# Altium project COBAND.PrjPcb
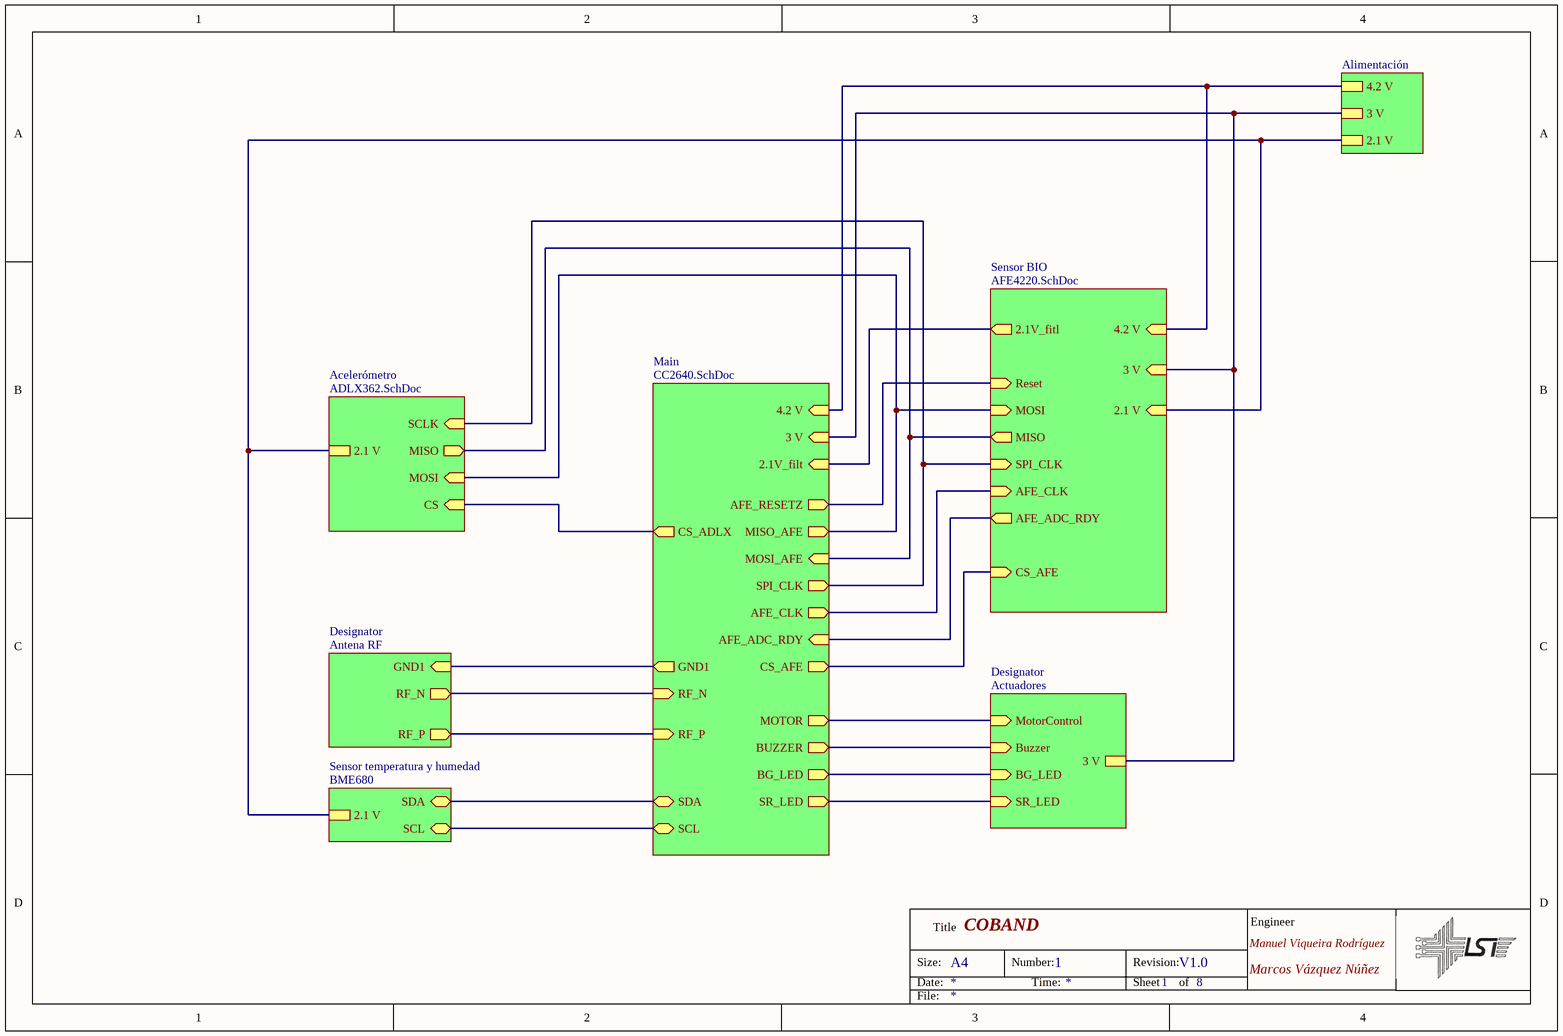
[diagram p0: main.SchDoc]
8 sheets, 70 parts. Net scope: hierarchical (ports join the sheet entries above them; power ports are global).
Board file: testDEOP.PcbDoc
Sheets:
  main.SchDoc
    Main = CC2640.SchDoc
    Designator = Antena RF.SchDoc
     = Alimentación.SchDoc
    Designator = Actuadores.SchDoc
    Acelerómetro = ADLX362.SchDoc
    Sensor temperatura y humedad = BME680.SchDoc
    Sensor BIO = AFE4220.SchDoc

## Sheet main.SchDoc: COBAND
size A4; ENG_APP_DATE: --/--/--; DSN_APP_DATE: --/--/--; CHK_APP_DATE: --/--/--; CompanyName: MUISE; Engineer: Manuel Viqueira Rodríguez; Organization: ETSI Telecomunicaciones; Address1: Av. Complutense, 30; Address2: , 28040 Madrid; Address3: Madrid; Address4: España; DocumentNumber: 1; Revision: V1.0; SheetNumber: 1; SheetTotal: 8; Engineer2: Marcos Vázquez Núñez

### Sub-sheets
Acelerómetro = ADLX362.SchDoc: MISO (out), MOSI (in), SCLK (in), CS (in), 2.1 V
Designator = Antena RF: RF_N (out), RF_P (out), GND1 (in)
Designator = Actuadores: MotorControl (in), Buzzer (in), BG_LED (in), SR_LED (in), 3 V
Main = CC2640.SchDoc: MOSI_AFE (in), AFE_RESETZ (out), MISO_AFE (out), SPI_CLK (out), AFE_ADC_RDY (in), BG_LED (out), SR_LED (out), MOTOR (out), BUZZER (out), CS_ADLX (out), RF_N (in), RF_P (in), SDA (bidir), SCL (bidir), AFE_CLK (out), CS_AFE (out), 2.1V_filt (in), 3 V (in), 4.2 V (in), GND1 (out)
Sensor BIO = AFE4220.SchDoc: Reset (in), SPI_CLK (in), MOSI (in), CS_AFE (in), AFE_CLK (in), MISO (out), AFE_ADC_RDY (out), 4.2 V (in), 3 V (in), 2.1 V (in), 2.1V_fitl (out)
Sensor temperatura y humedad = BME680: SDA (bidir), SCL (bidir), 2.1 V
? = Alimentación: 4.2 V, 3 V, 2.1 V

### Nets
GND1: sheet Main/GND1, sheet Designator/GND1
TX_SUP: sheet Main/4.2 V, sheet /4.2 V, sheet Sensor BIO/4.2 V
V2V1: sheet /2.1 V, sheet Acelerómetro/2.1 V, sheet Sensor temperatura y humedad/2.1 V, sheet Sensor BIO/2.1 V
V2V1_filt: sheet Main/2.1V_filt, sheet Sensor BIO/2.1V_fitl
VBAT: sheet Main/3 V, sheet /3 V, sheet Designator/3 V, sheet Sensor BIO/3 V
NetC20_2: sheet Main/RF_P, sheet Designator/RF_P
NetL5_1: sheet Main/RF_N, sheet Designator/RF_N
NetR1_2: sheet Main/AFE_CLK, sheet Sensor BIO/AFE_CLK
NetR8_1: sheet Main/MOTOR, sheet Designator/MotorControl
NetR9_1: sheet Main/BG_LED, sheet Designator/BG_LED
NetR10_1: sheet Main/SR_LED, sheet Designator/SR_LED
NetR11_1: sheet Main/BUZZER, sheet Designator/Buzzer
NetU1_E1: sheet Main/AFE_RESETZ, sheet Sensor BIO/Reset
NetU1_E2: sheet Main/MOSI_AFE, sheet Acelerómetro/MISO, sheet Sensor BIO/MISO
NetU1_E3: sheet Main/CS_AFE, sheet Sensor BIO/CS_AFE
NetU1_F2: sheet Main/MISO_AFE, sheet Acelerómetro/MOSI, sheet Sensor BIO/MOSI
NetU1_F3: sheet Main/SPI_CLK, sheet Acelerómetro/SCLK, sheet Sensor BIO/SPI_CLK
NetU1_F4: sheet Main/AFE_ADC_RDY, sheet Sensor BIO/AFE_ADC_RDY
NetU3_6: sheet Main/SCL, sheet Sensor temperatura y humedad/SCL
NetU3_7: sheet Main/SDA, sheet Sensor temperatura y humedad/SDA
NetU3_24: sheet Main/CS_ADLX, sheet Acelerómetro/CS

### Notes on the sheet
- Size:
- Date:
- Title
- A4
- Number:
- Time:
- Revision:
- Sheet
- of
- Engineer
- File:

## Sheet CC2640.SchDoc: Microcontrolador CC2640
size A4; CompanyName: MUISE; Engineer: Manuel Viqueira Rodríguez; Organization: ETSI Telecomunicaciones; Address1: Av. Complutense, 30; Address2: , 28040 Madrid; Address3: Madrid; Address4: España; DocumentNumber: 3; Revision: V1.0; SheetNumber: 3; SheetTotal: 8; Engineer2: Marcos Vazquez Nuñez
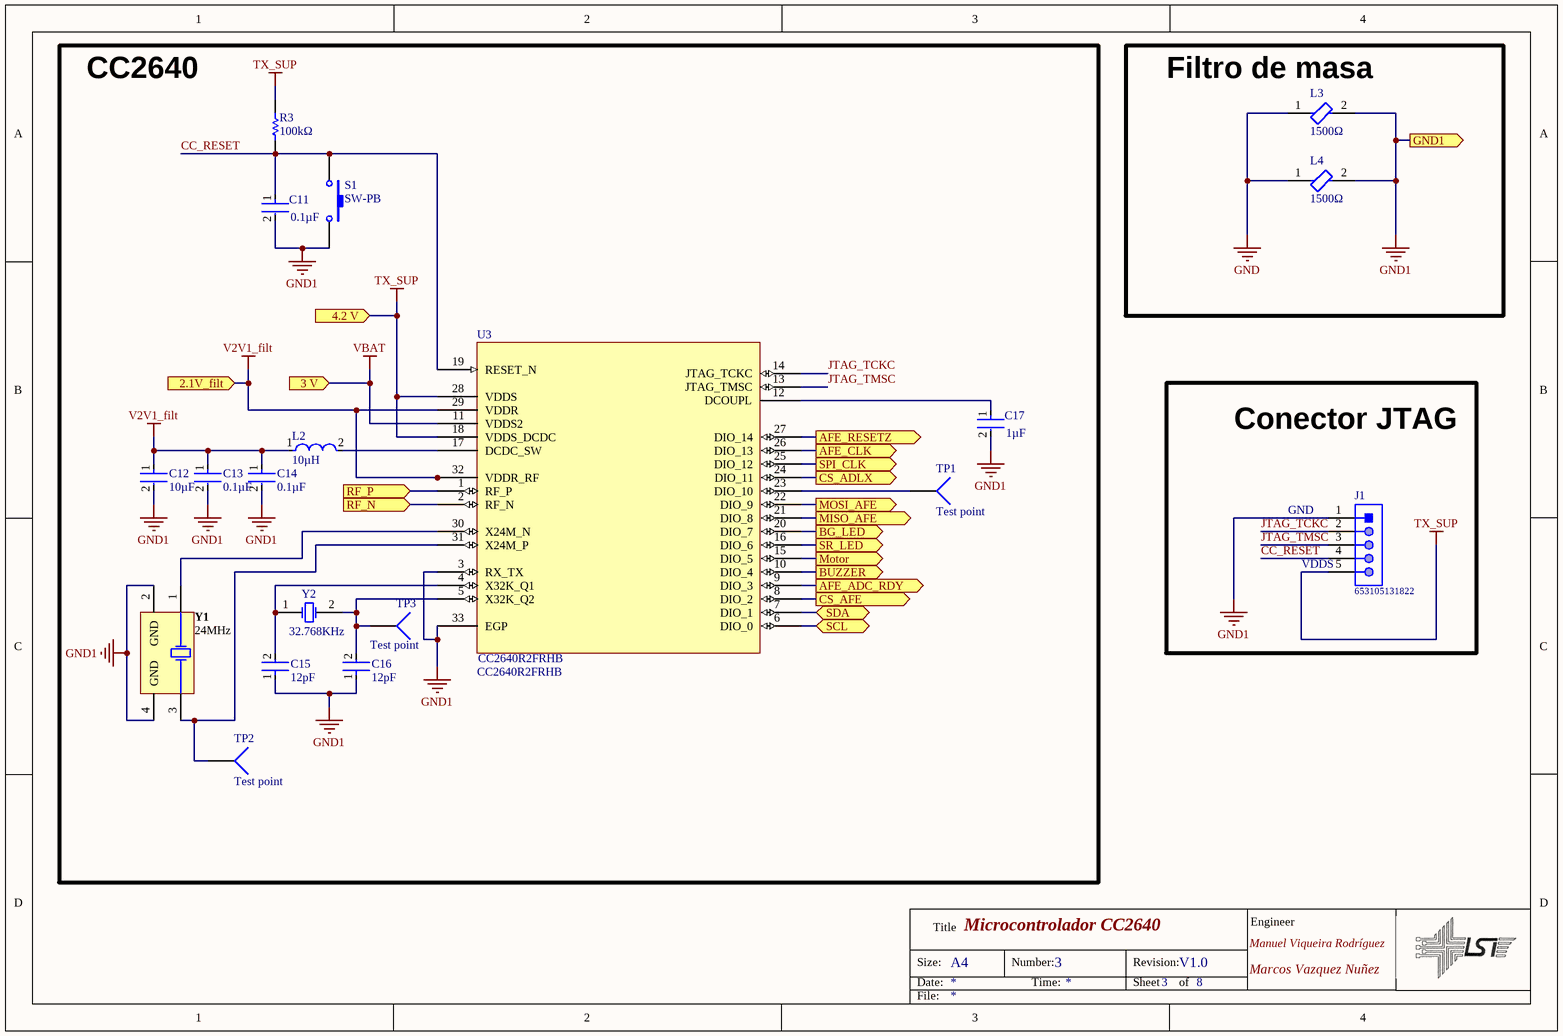
[diagram p1: CC2640.SchDoc]

### Parts
C11  0.1µF  [FP-CL10-IPC_B]
C12  10µF  [FP-CL10-IPC_B]
C13  0.1µF  [FP-CL10-IPC_B]
C14  0.1µF  [FP-CL10-IPC_B]
C15  12pF  [FP-CL10-IPC_B]
C16  12pF  [FP-CL10-IPC_B]
C17  1µF  [FP-CL10-IPC_B]
J1  653105131822  [653105131822]
L2  10µH  [FP-LQW15AN_00-W0_6-0_1-MFG]
L3  1500Ω  [FP-BLM18-0_15-t0_8-IPC_C]
L4  1500Ω  [FP-BLM18-0_15-t0_8-IPC_C]
R3  100kΩ  [RESC1005X40X25NL05T10]
S1  SW-PB  [SPST-2]
TP1  Test point  [PIN1]
TP2  Test point  [PIN1]
TP3  Test point  [PIN1]
U3  CC2640R2FRHB  [DEOP2021-Calle-Payno]
Y1  24MHz  [ABRA-ABM3B-4_V]
Y2  32.768KHz  [R38]

### Blocks framed on the sheet
CC2640: C11-C17 L2 R3 S1 TP1-TP3 U3 Y1 Y2
Filtro de masa: L3 L4
Conector JTAG: J1

### Ports
2.1V_filt (in), 3 V (in), 4.2 V (in), AFE_ADC_RDY (out), AFE_CLK (out), AFE_RESETZ (out), BG_LED (out), BUZZER (out), CS_ADLX (out), CS_AFE (out), GND1 (out), MISO_AFE (out), MOSI_AFE (out), Motor (out), RF_N (in), RF_P (in), SCL (bidir), SDA (bidir), SPI_CLK (out), SR_LED (out)

### Nets
GND: L3.1 L4.1
GND1: C11.2 C12.2 C13.2 C14.2 C15.1 C16.1 C17.2 J1.1 L3.2 L4.2 S1.2 U3.3(RX_TX) U3.33(EGP) Y1.2(GND) Y1.4(GND) ; port GND1
TX_SUP: J1.5 R3.2 U3.18(VDDS_DCDC) U3.28(VDDS) ; port 4.2 V
V2V1_filt: C12.1 C13.1 C14.1 L2.1 U3.29(VDDR) U3.32(VDDR_RF) ; port 2.1V_filt
VBAT: U3.11(VDDS2) ; port 3 V
CC_RESET: C11.1 J1.4 R3.1 S1.1 U3.19(RESET_N)
JTAG_TCKC: J1.2 U3.14(JTAG_TCKC)
JTAG_TMSC: J1.3 U3.13(JTAG_TMSC)
NetC15_2: C15.2 U3.4(X32K_Q1) Y2.1(OSC1)
NetC16_2: C16.2 TP3.1 U3.5(X32K_Q2) Y2.2(OSC2)
NetC17_1: C17.1 U3.12(DCOUPL)
NetC20_2: U3.1(RF_P) ; port RF_P
NetL2_2: L2.2 U3.17(DCDC_SW)
NetL5_1: U3.2(RF_N) ; port RF_N
NetR1_2: U3.26(DIO_13) ; port AFE_CLK
NetR8_1: U3.15(DIO_5) ; port Motor
NetR9_1: U3.20(DIO_7) ; port BG_LED
NetR10_1: U3.16(DIO_6) ; port SR_LED
NetR11_1: U3.10(DIO_4) ; port BUZZER
NetTP1_1: TP1.1 U3.23(DIO_10)
NetTP2_1: TP2.1 U3.31(X24M_P) Y1.3(X2)
NetU1_E1: U3.27(DIO_14) ; port AFE_RESETZ
NetU1_E2: U3.22(DIO_9) ; port MOSI_AFE
NetU1_E3: U3.8(DIO_2) ; port CS_AFE
NetU1_F2: U3.21(DIO_8) ; port MISO_AFE
NetU1_F3: U3.25(DIO_12) ; port SPI_CLK
NetU1_F4: U3.9(DIO_3) ; port AFE_ADC_RDY
NetU3_6: U3.6(DIO_0) ; port SCL
NetU3_7: U3.7(DIO_1) ; port SDA
NetU3_24: U3.24(DIO_11) ; port CS_ADLX
NetU3_30: U3.30(X24M_N) Y1.1(X1)

### Notes on the sheet
- (near J1) GND
- (near J1) VDDS
- Size:
- Date:
- Title
- A4
- Number:
- Time:
- Revision:
- Sheet
- of
- Engineer
- File:

### Library data of the parts
C11-C17 = CMP-13271-003245-1: Cap Ceramic 10uF 10V X5R ±10% Pad SMD 0603 +85°C T/R; Packaging: Tape and Reel; Dielectric: X5R; Min Operating Temperature: -55°C; Lead Free: Lead Free; Height: 0.8mm; Package Quantity: 10000; Voltage Rating (DC): 10V; Mount: Surface Mount; Tolerance: 10%; Width: 0.031inch; Thickness: 0.035inch; Depth: 0.8mm; Max Operating Temperature: 85°C; Capacitance: 10uF; Case/Package: 0603; Length: 1.6mm; Voltage Rating: 10V; Radiation Hardening: No
J1 = CMP-1502-00774-1: Male Shrouded Header WR-WTB, SMT, Right Angled, pitch 1.25 mm, 1 x 5 position; Manufacturer: Wurth Elektronik; Contact Resistance: 20mOhm; Working Voltage: 125VAC; Position: 1x5; Pitch: 1.25mm; Datasheet URL: https://katalog.we-online.de/em/datasheet/6531xx131822.pdf; Orientation: RightAngled; Package Reference: 653105131822; Operating Temperature: -40to85degC; Gender: Male; Publisher: WurthElektronik; Mounting Technology: SMT; Packaging: TapeandReel; Manufacturer URL: http://www.we-online.de; Part Number: 653105131822
L2 = CMP-2000-06595-2: Wire Wound RF Inductor 15nH ±5% 460mA 0.16Ω 0402 (1005); Test Frequency: 100MHz; DC Resistance (DCR): 160mR; Shielding: Unshielded; Q Factor: 30; Core Material: Air; Self Resonant Frequency: 5GHz; Resistor Type: Wirewound; DC Current: 460mA; Inductance: 15nH; Weight: 2.8E-05oz; Radiation Hardening: No; Depth: 0.7mm; Package Quantity: 10000; Case/Package: 0402; Packaging: Tape and Reel; Length: 1mm; Max DC Current: 460mA; Case Code (Imperial): 0402; Tolerance: 5%; Min Operating Temperature: -55°C; Lead Free: Lead Free; Width: 0.02inch; Case Code (Metric): 1005; Termination: SMD/SMT; Military Standard: Not; Current Rating: 460mA; Height: 0.5mm; Mount: Surface Mount; Max Operating Temperature: 125°C
L3 L4 = CMP-0686-00368-3: Chip Ferrite Bead, 0603, 1500Ω @ 100MHz, 0.5Ω, 25%, 500mA; Impedance: 1.5kR; DC Resistance (DCR): 500mR; Number of Circuits: 1; Test Frequency: 100MHz; Case/Package: 0603; Max Operating Temperature: 125°C; Package Quantity: 1; Max DC Current: 500mA; Tolerance: 25%; Core Material: Ferrite; Width: 0.8mm; Number of Pins: 2; Depth: 0.8mm; Radiation Hardening: No; Case Code (Imperial): 0603; Min Operating Temperature: -55°C; Termination: SMD/SMT; Material: Ferrite; Military Standard: Not; Number of Lines: 1; DC Current: 500mA; Length: 1.6mm; REACH SVHC: No SVHC; Lead Free: Lead Free; Current Rating: 500mA; Max Current Rating: 500mA; Packaging: Tape and Reel; Case Code (Metric): 1608; Height: 0.8mm
R3 = CMP-2002-06462-1: Part Number: ERJ-U02F1501X; Manufacturer: Panasonic
S1 = SW-PB: Switch; Published: 24-Mar-1999; LatestRevisionDate: 17-Jul-2002; LatestRevisionNote: Re-released for DXP Platform.; PackageReference: SPST-2; Publisher: Altium Limited; PackageDescription: Switch; 2 Leads
TP1-TP3 = Socket: LatestRevisionDate: 17-Jul-2002; LatestRevisionNote: Re-released for DXP Platform.; Publisher: Altium Limited
Y1 = CMP-1688-00008-1: Ceramic SMD Crystal, 24 MHz, +/- 20 ppm, 50 Ohm, -20 to 70 degC, 4-Pin SMD, RoHS, Tape and Reel; Impedance: 50 Ohm; Mating Cycles: 30; Frequency: 6 Hz; Contact Material: Brass; Contact Plating: Gold; PackageReference: ABM3B; Min Operating Temperature: -40 degC; ComponentLink2Description: Datasheet; Radiation Hardening: No; DatasheetVersion: Aug-15; Packaging: Tape and Reel; Length: 2.6 mm; Package Quantity: 2500; REACH SVHC: Unknown; PackageDescription: 4-Pin Surface Mount Device, Body 5 x 3.2 mm; Weight: 0.001058 oz; ComponentLink2URL: http://www.abracon.com/Resonators/abm3b.pdf; ComponentLink1Description: Manufacturer URL; Width: 3 mm; RoHSCompliant: true; Fastening Type: Snap; Max Operating Temperature: 155 degC; ComponentLink1URL: http://www.abracon.com/; Height: 1.244 mm; Mount: Surface Mount
Y2 = XTAL: Crystal Oscillator; Published: 8-Jun-2000; LatestRevisionDate: 17-Jul-2002; LatestRevisionNote: Re-released for DXP Platform.; PackageReference: R38; Publisher: Altium Limited; PackageDescription: Crystal, Thru-Hole; 2 Leads; Body 3.1 x 8.2 mm (Dia.xH)

## Sheet Antena RF.SchDoc: Antena R/F
size A4; CompanyName: MUISE; Engineer: Manuel Viqueira Rodríguez; Organization: ETSI Telecomunicaciones; Address1: Av. Complutense, 30; Address2: , 28040 Madrid; Address3: Madrid; Address4: España; DocumentNumber: 4; Revision: V1.0; SheetNumber: 4; SheetTotal: 8; Engineer2: Marcos Vazquez Nuñez
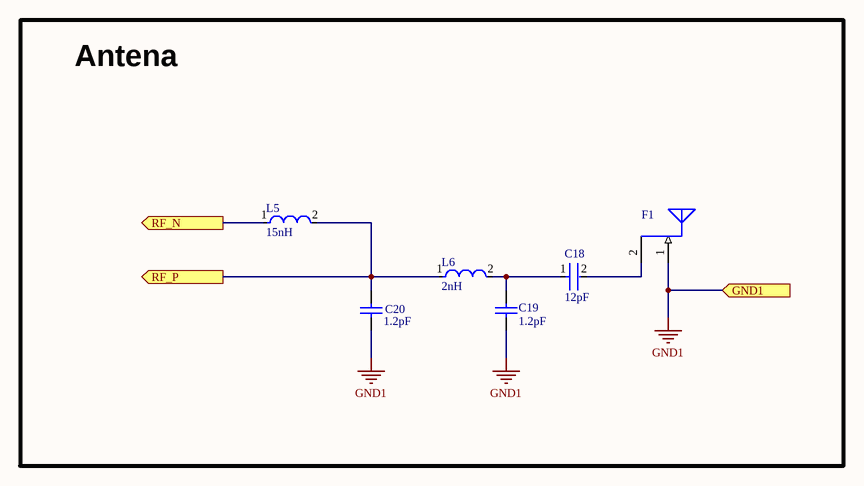
[diagram p2: Antena RF.SchDoc]

### Parts
C18  12pF  [FP-C0603C-CF-MFG]
C19  1.2pF  [CAPC1005X55X25ML05T10]
C20  1.2pF  [CAPC1005X55X25ML05T10]
F1  -  [PCBAntenna]  (value not drawn)  (net tie, no BOM)
L5  15nH  [FP-LQW15AN_00-W0_6-0_1-MFG]
L6  2nH  [FP-LQW15AN_00-W0_6-0_1-MFG]

### Blocks framed on the sheet
Antena: C18-C20 F1 L5 L6

### Ports
GND1 (in), RF_N (out), RF_P (out)

### Nets
GND1: C19.1 C20.1 F1.1(FeedPoint) ; port GND1
NetC18_1: C18.1 C19.2 L6.2
NetC18_2: C18.2 F1.2(GND)
NetC20_2: C20.2 L5.2 L6.1 ; port RF_P
NetL5_1: L5.1 ; port RF_N

### Notes on the sheet
- Size:
- Date:
- Title
- A4
- Number:
- Time:
- Revision:
- Sheet
- of
- Engineer
- File:

### Library data of the parts
C18 = CMP-1035-00616-2: CAP CER 12PF 50V NP0 0603; Manufacturer: KEMET; Manufacturer Part Number: C0603C120D5GACTU; Temperature Characteristic: C0G; Tolerance: 0.5 pF; Automotive Grade: Grade 1; Material: Ceramic; Temperature Coefficient: 30ppm/°C; Automotive: Yes; Temperature Range High: +125°C; Value: 12 pF; Package: C0603C-CF; Device Class L1: Passive Components; Temperature: -55°C to +125°C; Octopart: https://octopart.com/c0603c120d5gactu-kemet-9143898; Lead Free: Yes; ComponentLink2URL: https://api.kemet.com/component-edge/download/datasheet/C0603C100J5GACAUTO.pdf; Device Class L3: Ceramic Capacitors; Height: 0.87mm; Mouser Description: Multilayer Ceramic Capacitors MLCC - SMD/SMT 50volts 12pF C0G 0.5%; RoHS: TRUE; Digikey Description: CAP CER 12PF 50V NP0 0603; Capacitance: 12 pF; Voltage Rating: 50 V; Temperature Range Low: -55°C; Device Class L2: Capacitors; Category: Cap; ComponentLink2Description: Datasheet
C19 C20 = CMP-2008-04279-1: Manufacturer: Murata; Part Number: GRM1555C1H1R2BA01D
F1 = PCBAntenna: GND pin has a via to a GND plane that is not included in the footprint, but has to be included in the final PCB layout design.
L5 = CMP-2000-06595-2: as L2 on sheet CC2640; Resistor Type: Wirewound; DC Current: 460mA; Inductance: 15nH; Weight: 2.8E-05oz; Radiation Hardening: No; Depth: 0.7mm; Package Quantity: 10000; Case/Package: 0402; Packaging: Tape and Reel; Length: 1mm; Max DC Current: 460mA; Case Code (Imperial): 0402; Tolerance: 5%; Min Operating Temperature: -55°C; Lead Free: Lead Free; Width: 0.02inch; Case Code (Metric): 1005; Termination: SMD/SMT; Military Standard: Not; Current Rating: 460mA; Height: 0.5mm; Mount: Surface Mount; Max Operating Temperature: 125°C
L6 = CMP-06042-008059-1: Wire Wound RF Inductor 2.4nH ±0.1nH 850mA 0.05Ω 0402 (1005); Tolerance: 2%; Shielding: Unshielded; Core Material: Air; Current: 260mA; DC Resistance (DCR): 50mR; Q Factor: 20; Self Resonant Frequency: 15GHz; Test Frequency: 100MHz; Termination: SMD/SMT; Weight: 2.8E-05oz; Mount: Surface Mount; REACH SVHC: No SVHC; Current Rating: 850mA; Case/Package: 0402; Depth: 0.7mm; Packaging: Tape and Reel; Military Standard: Not; Radiation Hardening: No; Width: 0.02inch; DC Current: 850mA; Height: 0.5mm; Case Code (Metric): 1005; Inductance: 2.4nH; Package Quantity: 10000; Max DC Current: 850mA; Max Operating Temperature: 125°C; Lead Free: Lead Free; Min Operating Temperature: -55°C; Case Code (Imperial): 0402; Length: 1mm; Resistor Type: Wirewound

## Sheet Alimentación.SchDoc: Alimentación
size A4; CompanyName: MUISE; Engineer: Manuel Viqueira Rodríguez; Organization: ETSI Telecomunicaciones; Address1: Av. Complutense, 30; Address2: , 28040 Madrid; Address3: Madrid; Address4: España; DocumentNumber: 5; Revision: V1.0; SheetNumber: 5; SheetTotal: 8; Engineer2: Marcos Vazquez Nuñez
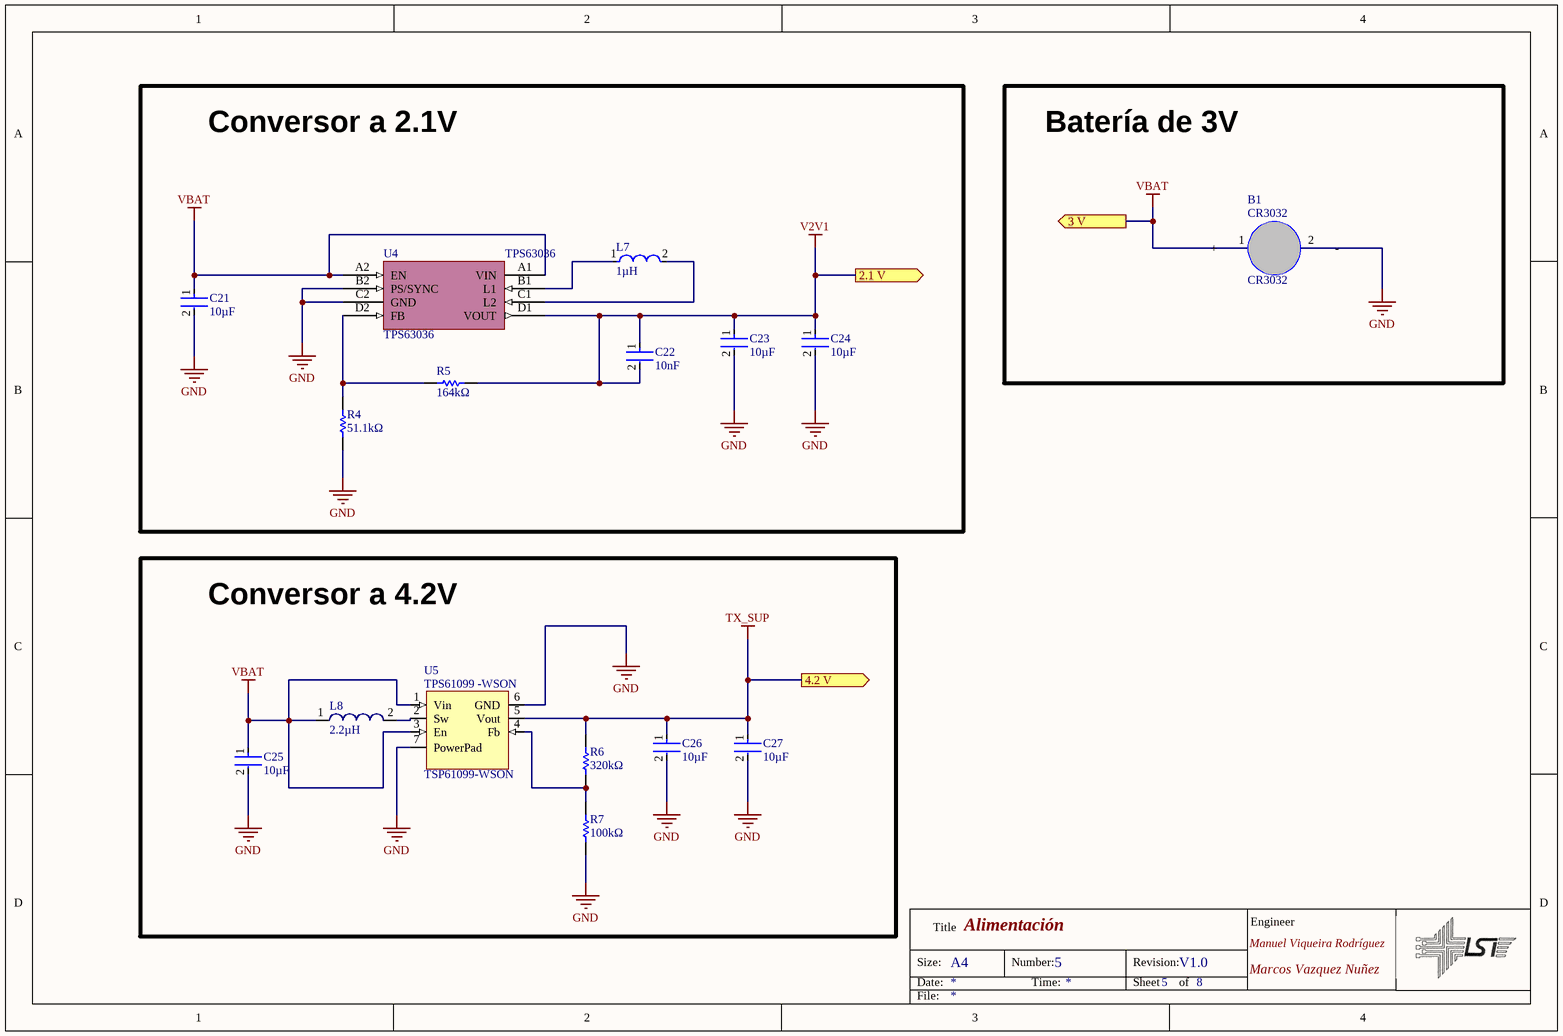
[diagram p3: Alimentación.SchDoc]

### Parts
B1  CR3032  [CR3032]
C21  10µF  [FP-CL10-IPC_B]
C22  10nF  [FP-CL10-IPC_C]
C23  10µF  [FP-CL10-IPC_B]
C24  10µF  [FP-CL10-IPC_B]
C25  10µF  [FP-CL10-IPC_B]
C26  10µF  [FP-CL10-IPC_B]
C27  10µF  [FP-CL10-IPC_B]
L7  1µH  [FP-MLZ1608-MFG]
L8  2.2µH  [SMD 2508]
R4  51.1kΩ  [RESC1005X40X25NL05T10]
R5  164kΩ  [RESC1005X40X25NL05T10]
R6  320kΩ  [RESC1005X40X25NL05T10]
R7  100kΩ  [RESC1005X40X25NL05T10]
U4  TPS63036  [tps63036]
U5  TSP61099-WSON  [SOP6]

### Blocks framed on the sheet
Conversor a 2.1V: C21-C24 L7 R4 R5 U4
Batería de 3V: B1
Conversor a 4.2V: C25-C27 L8 R6 R7 U5

### Ports
2.1 V (out), 3 V (out), 4.2 V (out)

### Nets
GND: B1.2(-) C21.2 C23.2 C24.2 C25.2 C26.2 C27.2 R4.1 R7.1 U4.B2(PS/SYNC) U4.C2(GND) U5.6(GND) U5.7(PowerPad)
TX_SUP: C26.1 C27.1 R6.2 U5.5(Vout) ; port 4.2 V
V2V1: C22.1 C22.2 C23.1 C24.1 R5.2 U4.D1(VOUT) ; port 2.1 V
VBAT: B1.1(+) C21.1 C25.1 L8.1 U4.A1(VIN) U4.A2(EN) U5.1(Vin) U5.3(En) ; port 3 V
NetL7_1: L7.1 U4.B1(L1)
NetL7_2: L7.2 U4.C1(L2)
NetL8_2: L8.2 U5.2(Sw)
NetR4_2: R4.2 R5.1 U4.D2(FB)
NetR6_1: R6.1 R7.2 U5.4(Fb)

### Notes on the sheet
- Size:
- Date:
- Title
- A4
- Number:
- Time:
- Revision:
- Sheet
- of
- Engineer
- File:
- (in symbol TSP61099-WSON) TPS61099 -WSON

### Library data of the parts
C21 C23-C27 = CMP-13271-003245-1: as C11 on sheet CC2640; Packaging: Tape and Reel; Dielectric: X5R; Min Operating Temperature: -55°C; Lead Free: Lead Free; Height: 0.8mm; Package Quantity: 10000; Voltage Rating (DC): 10V; Mount: Surface Mount; Tolerance: 10%; Width: 0.031inch; Thickness: 0.035inch; Depth: 0.8mm; Max Operating Temperature: 85°C; Capacitance: 10uF; Case/Package: 0603; Length: 1.6mm; Voltage Rating: 10V; Radiation Hardening: No
C22 = CMP-13271-000193-1: Cap Ceramic 10nF 50V X7R ±20% Pad SMD 0603 +125°C T/R; Voltage Rating (DC): 50V; Radiation Hardening: No; Packaging: Tape and Reel; Depth: 0.8mm; Package Quantity: 4000; Max Operating Temperature: 125°C; Length: 1.6mm; Voltage Rating: 50V; Case/Package: 0603; Dielectric: X7R; Mount: Surface Mount; Tolerance: 20%; Thickness: 0.035inch; Capacitance: 10nF; Height: 0.8mm; Lead Free: Lead Free; Case Code (Metric): 1608; Width: 0.031inch; Min Operating Temperature: -55°C; Case Code (Imperial): 0603
L7 = CMP-08253-000001-1: FIXED IND 1UH 600MA 150 MOHM SMD; Manufacturer Part Number: MLZ1608A1R0WT000; Manufacturer: TDK; Core Material: Ferrite; Series Resistance: 0.195Ω; Tolerance: 20%; Saturation Current: 190mA; Test Frequency: 10MHz; Shielding: true; Height: 0.95mm; Category: Ind; Value: 1uH; Device Class L2: Inductors; Lead Free: Yes; Automotive: No; RoHS: TRUE; Device Class L1: Passive Components; Package: MLZ1608; Inductance: 1uH; Temperature Range High: +125°C; Ipc Land Pattern Name: CAPC16080X80; Composition: Multilayer; Mouser Description: Inductor Power Shielded Multi-Layer 1uH 20% 10MHz Ferrite 0.19A 0.195Ohm DCR 0603 T/R; ComponentLink2Description: Datasheet; Digikey Description: FIXED IND 1UH 600MA 150 MOHM SMD; Temperature Range Low: -55°C; Temperature: -55°C to +125°C; Device Class L3: Fixed Inductors; Octopart: https://octopart.com/mlz1608a1r0wt000-tdk-34829250; ComponentLink2URL: https://product.tdk.com/info/en/catalog/datasheets/inductor_commercial_decoupling_mlz1608_en.pdf
L8 = CMP-1411-00004-1: Power Multilayer Inductor WE-MAPI, L=2.2µH; PartNumber: 74438322022; Manufacturer: Wuerth Elektronik; Inductance: 2.2ÂµH; ComponentLink2URL: http://katalog.we-online.de/kataloge/eisos/media/pdf/74438322022.pdf; ComponentLink1Description: Manufacturer URL; ComponentLink2Description: Datasheet; ComponentLink1URL: http://www.we-online.com; PackageReference: SMD 2508
R4-R7 = CMP-2002-06462-1: as R3 on sheet CC2640
U4 = TPS63036: Non-inverting buck-boost / converter able to provide a regulated output voltage / from an input supply that can be higher or lower than / the output voltage

## Sheet Actuadores.SchDoc: Actuadores
size A4; CompanyName: MUISE; Engineer: Manuel Viqueira Rodríguez; Organization: ETSI Telecomunicaciones; Address1: Av. Complutense, 30; Address2: , 28040 Madrid; Address3: Madrid; Address4: España; DocumentNumber: 6; Revision: V1.0; SheetNumber: 6; SheetTotal: 8; Engineer2: Marcos Vázquez Núñez
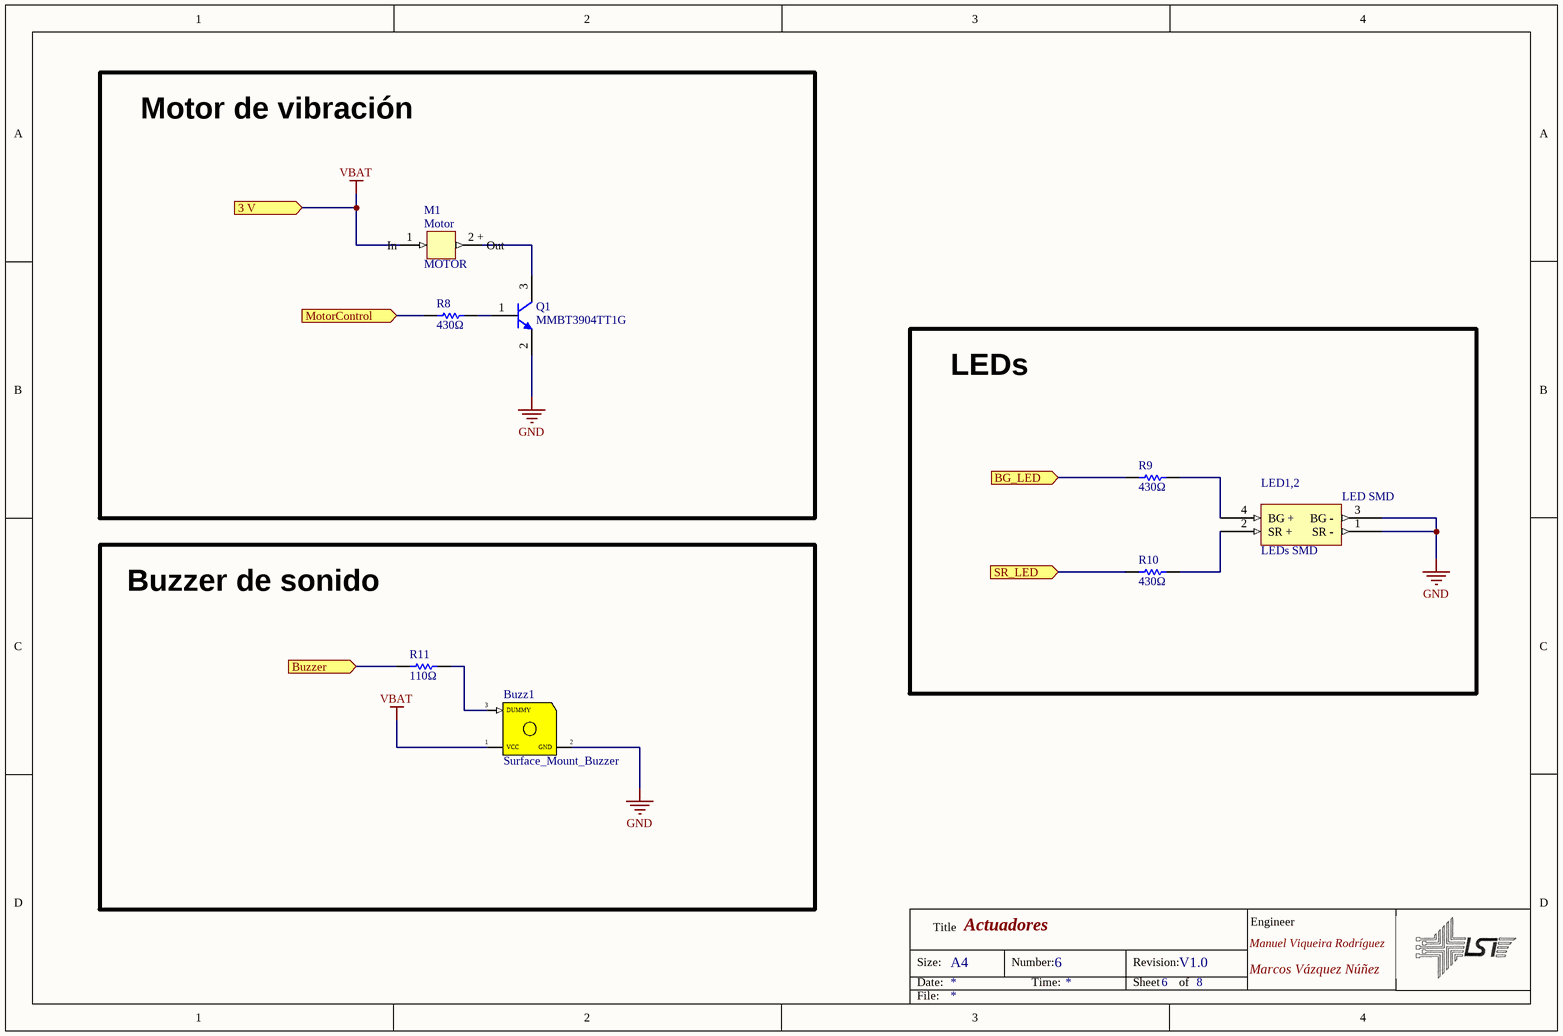
[diagram p4: Actuadores.SchDoc]

### Parts
Buzz1  Surface_Mount_Buzzer  [buzzer]
LED1,2  LEDs SMD  [LED_SMD]
M1  MOTOR  [Motor]
Q1  MMBT3904TT1G  [ONSC-SC-75-3-463-01_V]
R8  430Ω  [RESC1005X40X25NL05T10]
R9  430Ω  [RESC1005X40X25NL05T10]
R10  430Ω  [RESC1005X40X25NL05T10]
R11  110Ω  [RESC1005X40X25NL05T10]

### Blocks framed on the sheet
Motor de vibración: M1 Q1 R8
LEDs: LED1,2 R9 R10
Buzzer de sonido: Buzz1 R11

### Ports
3 V (in), BG_LED (in), Buzzer (in), MotorControl (in), SR_LED (in)

### Nets
GND: Buzz1.2(GND) LED1,2.1(SR_-) LED1,2.3(BG_-) Q1.2(E)
VBAT: Buzz1.1(VCC) M1.1(In) ; port 3 V
NetBuzz1_3: Buzz1.3(DUMMY) R11.2
NetLED1,2_2: LED1,2.2(SR_+) R10.2
NetLED1,2_4: LED1,2.4(BG_+) R9.2
NetM1_2 +: M1.2_+(Out) Q1.3(C)
NetQ1_1: Q1.1(B) R8.2
NetR8_1: R8.1 ; port MotorControl
NetR9_1: R9.1 ; port BG_LED
NetR10_1: R10.1 ; port SR_LED
NetR11_1: R11.1 ; port Buzzer

### Notes on the sheet
- Size:
- Date:
- Title
- A4
- Number:
- Time:
- Revision:
- Sheet
- of
- Engineer
- File:
- (in symbol LED) LED SMD
- (in symbol MOTOR) Motor

### Library data of the parts
LED1,2 = LED
Q1 = CMP-1048-00420-1: General Purpose Transistor, NPN Silicon, 3-Pin SC-75, Pb-Free, Tape and Reel; Manufacturer: On Semiconductor; IC Continuous (A): 0.2; fT Min (MHz): 300; ComponentLink3URL: http://www.onsemi.com/pub_link/Collateral/463-01.PDF; DatasheetVersion: Rev. 5; RoHS: TRUE; Mounting Technology: Surface Mount; ComponentLink1URL: http://www.onsemi.com/; ComponentLink3Description: Package Specification; PackageReference: SC-75-3-463-01; Polarity: NPN; ComponentLink2Description: Datasheet; PackageVersion: Rev. F, 07/2005; PartNumber: MMBT3904TT1G; ComponentLink2URL: http://www.onsemi.cn/pub_link/Collateral/MMBT3904TT1-D.PDF; ComponentLink1Description: Manufacturer URL; PackageDescription: 3-Pin Small Outline Transistor, Body 1.6 x 0.8 mm, Pitch 0.5 mm; Packing: Tape and Reel
R8-R11 = CMP-2002-06462-1: as R3 on sheet CC2640

## Sheet ADLX362.SchDoc: Acelerómetro
size A4; CompanyName: MUISE; Engineer: Manuel Viqueira Rodríguez; Organization: ETSI Telecomunicaciones; Address1: Av. Complutense, 30; Address2: , 28040 Madrid; Address3: Madrid; Address4: España; DocumentNumber: 7; Revision: V1.0; SheetNumber: 7; SheetTotal: 8; Engineer2: Marcos Vazquez Nuñez
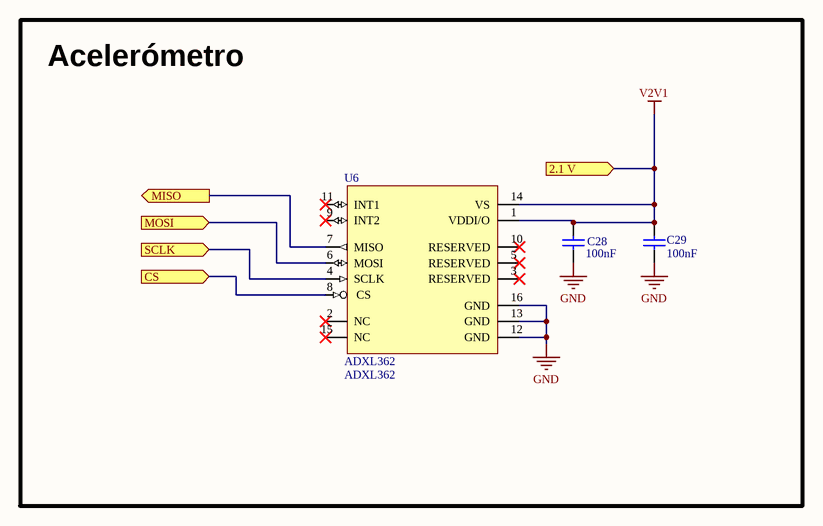
[diagram p5: ADLX362.SchDoc]

### Parts
C28  100nF  [CAPC1005X55X25ML05T10]
C29  100nF  [CAPC1005X55X25ML05T10]
U6  ADXL362  [ADXL362 - duplicate]

### Blocks framed on the sheet
Acelerómetro: C28 C29 U6

### Ports
2.1 V (in), CS (in), MISO (out), MOSI (in), SCLK (in)

### Nets
GND: C28.1 C29.1 U6.12(GND) U6.13(GND) U6.16(GND)
V2V1: C28.2 C29.2 U6.1(VDDI/O) U6.14(VS) ; port 2.1 V
NetU1_E2: U6.7(MISO) ; port MISO
NetU1_F2: U6.6(MOSI) ; port MOSI
NetU1_F3: U6.4(SCLK) ; port SCLK
NetU3_24: U6.8(CS) ; port CS

Not connected (* = marked no-connect by the designer): U6 2(NC)* 3(RESERVED)* 5(RESERVED)* 9(INT2)* 10(RESERVED)* 11(INT1)* 15(NC)*

### Notes on the sheet
- Size:
- Date:
- Title
- A4
- Number:
- Time:
- Revision:
- Sheet
- of
- Engineer
- File:

### Library data of the parts
C28 C29 = CMP-2008-04279-1: as C19 on sheet Antena RF

## Sheet BME680.SchDoc: Sensor Temp / humedad
size A4; CompanyName: MUISE; Engineer: Manuel Viqueira Rodríguez; Organization: ETSI Telecomunicaciones; Address1: Av. Complutense, 30; Address2: , 28040 Madrid; Address3: Madrid; Address4: España; DocumentNumber: 8; Revision: V1.0; SheetNumber: 8; SheetTotal: 8; Engineer2: Marcos Vazquez Nuñez
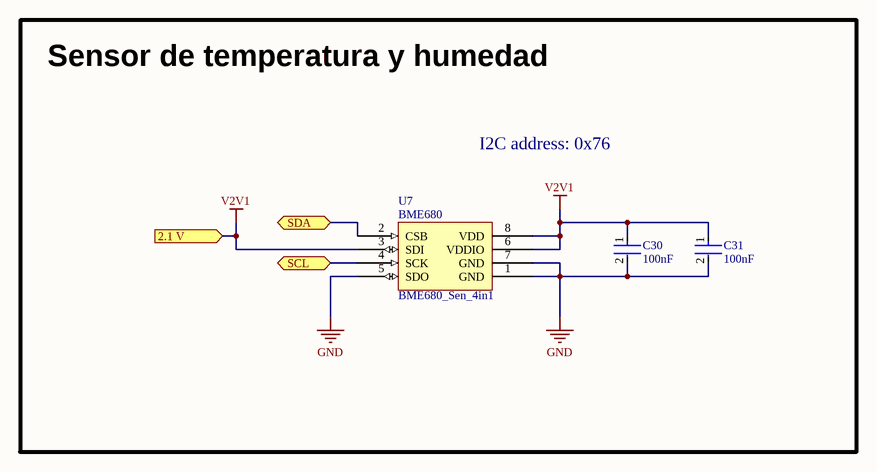
[diagram p6: BME680.SchDoc]

### Parts
C30  100nF  [FP-CL10-IPC_B]
C31  100nF  [FP-CL10-IPC_B]
U7  BME680_Sen_4in1  [BME_LGA8]

### Blocks framed on the sheet
Sensor de temperatura y humedad: C30 C31 U7

### Ports
2.1 V (in), SCL (bidir), SDA (bidir)

### Nets
GND: C30.2 C31.2 U7.1(GND) U7.5(SDO) U7.7(GND)
V2V1: C30.1 C31.1 U7.3(SDI) U7.6(VDDIO) U7.8(VDD) ; port 2.1 V
NetU3_6: U7.4(SCK) ; port SCL
NetU3_7: U7.2(CSB) ; port SDA

### Notes on the sheet
- I2C address: 0x76
- Size:
- Date:
- Title
- A4
- Number:
- Time:
- Revision:
- Sheet
- of
- Engineer
- File:
- (in symbol BME680_Sen_4in1) BME680

### Library data of the parts
C30 C31 = CMP-13271-003245-1: as C11 on sheet CC2640; Packaging: Tape and Reel; Dielectric: X5R; Min Operating Temperature: -55°C; Lead Free: Lead Free; Height: 0.8mm; Package Quantity: 10000; Voltage Rating (DC): 10V; Mount: Surface Mount; Tolerance: 10%; Width: 0.031inch; Thickness: 0.035inch; Depth: 0.8mm; Max Operating Temperature: 85°C; Capacitance: 10uF; Case/Package: 0603; Length: 1.6mm; Voltage Rating: 10V; Radiation Hardening: No

## Sheet AFE4220.SchDoc: Sensor BIO
size A4; CompanyName: MUISE; Engineer: Manuel Viqueira Rodríguez; Organization: ETSI Telecomunicaciones; Address1: Av. Complutense, 30; Address2: , 28040 Madrid; Address3: Madrid; Address4: España; DocumentNumber: 2; Revision: V1.0; SheetNumber: 2; SheetTotal: 8; Engineer2: Marcos Vazquez Nuñez
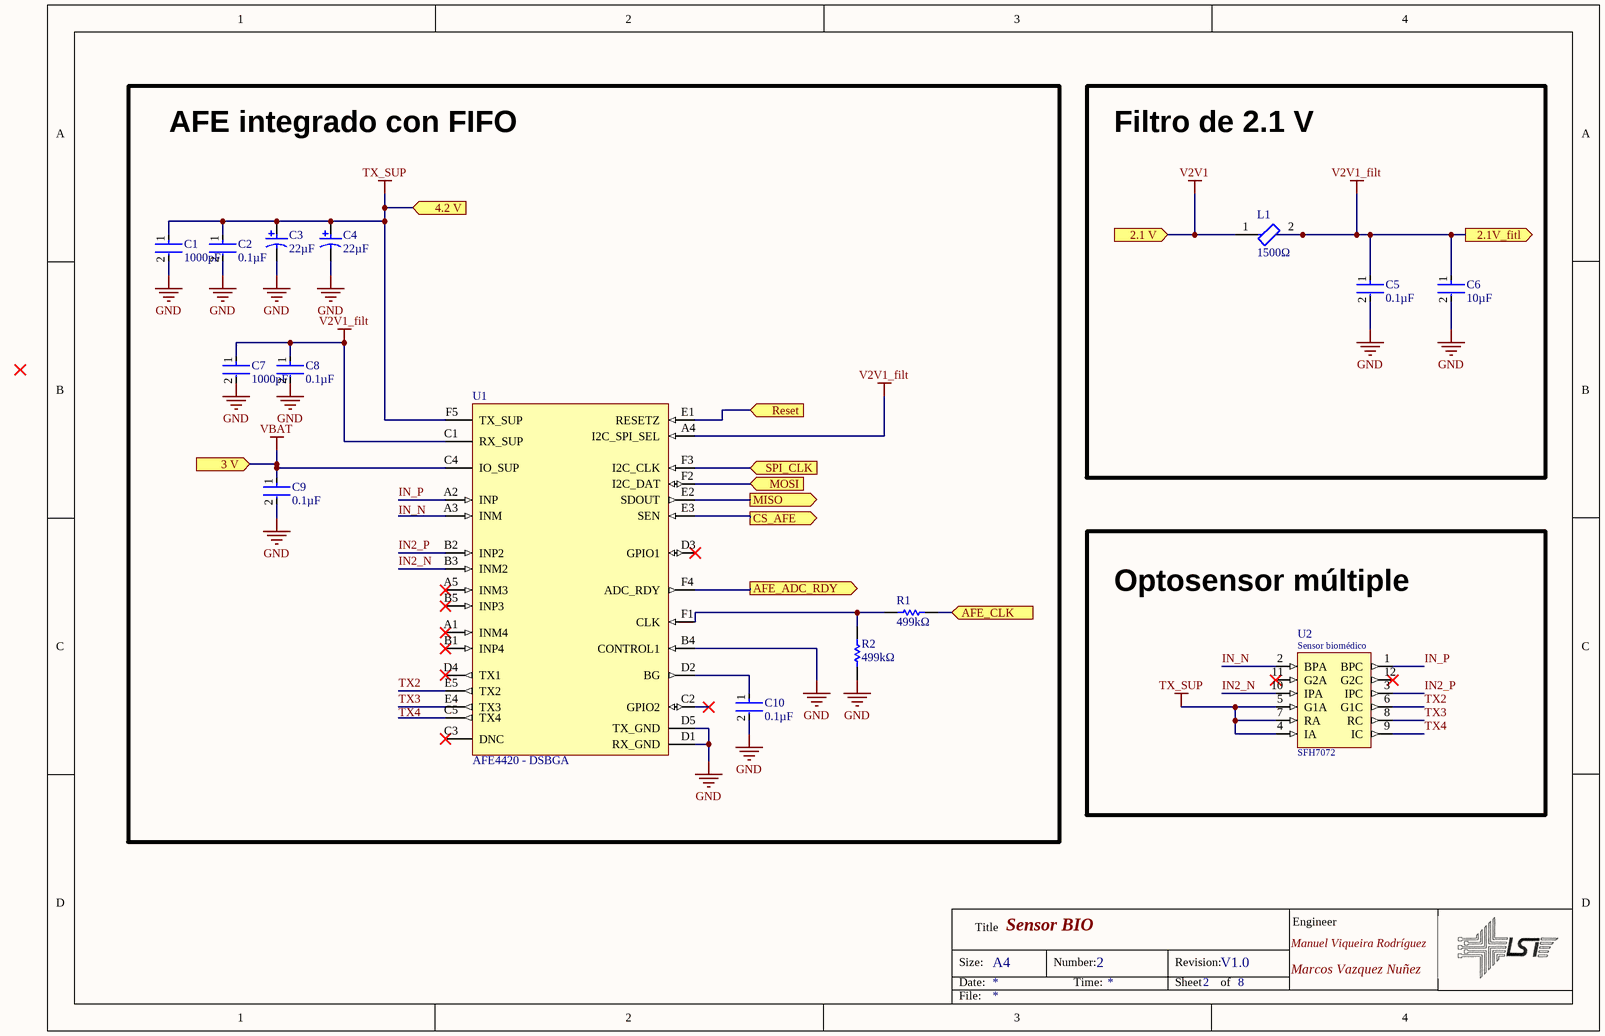
[diagram p7: AFE4220.SchDoc]

### Parts
C1  1000pF  [FP-CL10-IPC_B]
C2  0.1µF  [FP-CL10-IPC_B]
C3  22µF  [NIC-CAPA2-4X5.8_V]
C4  22µF  [NIC-CAPA2-4X5.8_V]
C5  0.1µF  [FP-CL10-IPC_B]
C6  10µF  [FP-CL10-IPC_B]
C7  1000pF  [FP-CL10-IPC_B]
C8  0.1µF  [FP-CL10-IPC_B]
C9  0.1µF  [FP-CL10-IPC_B]
C10  0.1µF  [FP-CL10-IPC_B]
L1  1500Ω  [FP-BLM18-0_15-t0_8-IPC_C]
R1  499kΩ  [RESC1005X40X25NL05T10]
R2  499kΩ  [RESC1005X40X25NL05T10]
U1  AFE4420 - DSBGA  [AFE4420 - DSBGA]
U2  (no value)  [SFH7072]

### Blocks framed on the sheet
AFE integrado con FIFO: C1-C4 C7-C10 R1 R2 U1
Filtro de 2.1 V: C5 C6 L1
Optosensor múltiple: U2

### Ports
2.1 V (in), 2.1V_fitl (out), 3 V (in), 4.2 V (in), AFE_ADC_RDY (out), AFE_CLK (in), CS_AFE (out), MISO (out), MOSI (in), Reset (in), SPI_CLK (in)

### Nets
GND: C1.2 C2.2 C3.2 C4.2 C5.2 C6.2 C7.2 C8.2 C9.2 C10.2 R2.1 U1.B4(CONTROL1) U1.D1(RX_GND) U1.D5(TX_GND)
TX_SUP: C1.1 C2.1 C3.1 C4.1 U1.F5(TX_SUP) U2.4(IA) U2.5(G1A) U2.7(RA) ; port 4.2 V
V2V1: L1.1 ; port 2.1 V
V2V1_filt: C5.1 C6.1 C7.1 C8.1 L1.2 U1.A4(I2C_SPI_SEL) U1.C1(RX_SUP) ; port 2.1V_fitl
VBAT: C9.1 U1.C4(IO_SUP) ; port 3 V
IN2_N: U1.B3(INM2) U2.10(IPA)
IN2_P: U1.B2(INP2) U2.3(IPC)
IN_N: U2.2(BPA)
IN_P: U1.A2(INP) U2.1(BPC)
TX2: U1.E5(TX2) U2.6(G1C)
TX3: U1.E4(TX3) U2.8(RC)
TX4: U2.9(IC)
NetC10_1: C10.1 U1.D2(BG)
NetR1_1: R1.1 R2.2 U1.F1(CLK)
NetR1_2: R1.2 ; port AFE_CLK
NetU1_E1: U1.E1(RESETZ) ; port Reset
NetU1_E2: U1.E2(SDOUT) ; port MISO
NetU1_E3: U1.E3(SEN) ; port CS_AFE
NetU1_F2: U1.F2(I2C_DAT) ; port MOSI
NetU1_F3: U1.F3(I2C_CLK) ; port SPI_CLK
NetU1_F4: U1.F4(ADC_RDY) ; port AFE_ADC_RDY

Not connected (* = marked no-connect by the designer): U1 A1(INM4)* A3(INM) A5(INM3)* B1(INP4)* B5(INP3)* C2(GPIO2)* C3(DNC)* C5(TX4) D3(GPIO1)* D4(TX1)*; U2 11(G2A)* 12(G2C)*

### Notes on the sheet
- Labels drawn without touching a wire or pin: IN_N, TX4
- Size:
- Date:
- Title
- A4
- Number:
- Time:
- Revision:
- Sheet
- of
- Engineer
- File:
- (in symbol SFH7072) Sensor biomédico

### Library data of the parts
C1 C2 C5-C10 = CMP-13271-003245-1: as C11 on sheet CC2640; Packaging: Tape and Reel; Dielectric: X5R; Min Operating Temperature: -55°C; Lead Free: Lead Free; Height: 0.8mm; Package Quantity: 10000; Voltage Rating (DC): 10V; Mount: Surface Mount; Tolerance: 10%; Width: 0.031inch; Thickness: 0.035inch; Depth: 0.8mm; Max Operating Temperature: 85°C; Capacitance: 10uF; Case/Package: 0603; Length: 1.6mm; Voltage Rating: 10V; Radiation Hardening: No
C3 C4 = CMP-0687-00010-1: Aluminum Electrolytic Capacitor, UD Series, Low Impedance, 22 uF, 10 V, + / - 20%, -55 to 105 degC, Chip Type, 4 x 5.8 mm D x L, Pb-Free, Reel; Manufacturer: Nichicon; PartNumber: UUD1A220MCL1GS; Endurance Time: 2000 h; Packing: Dia382mm Reel; Tolerance Rated Capacitance: -20 to 20%; Rated Ripple Current (at 100kHz): 80 mA; Impedance: 1.8 Ohm; Rated Capacitance: 22 uF; Rated Voltage: 10 V; ComponentLink3URL: http://products.nichicon.co.jp/en/pdf/XJA043/e-ud.pdf; ComponentLink2URL: http://products.nichicon.co.jp/en/pdf/XJA043/e-ud.pdf; ComponentLink2Description: Datasheet; ComponentLink1URL: http://www.nichicon.co.jp/; DatasheetVersion: 08/2012; PackageDescription: 2-Pin Surface Mount Device, Diameter 4 mm, Height 5.8 mm, Pitch 3.6 mm; PackageReference: CAPAE-D4H5.8; ComponentLink1Description: Manufacturer URL; Length: 5.8 mm; Diameter: 4 mm; ComponentLink3Description: Package Specification; Mounting Technology: Surface Mount; RoHS: TRUE
L1 = CMP-0686-00368-3: as L3 on sheet CC2640; Test Frequency: 100MHz; Case/Package: 0603; Max Operating Temperature: 125°C; Package Quantity: 1; Max DC Current: 500mA; Tolerance: 25%; Core Material: Ferrite; Width: 0.8mm; Number of Pins: 2; Depth: 0.8mm; Radiation Hardening: No; Case Code (Imperial): 0603; Min Operating Temperature: -55°C; Termination: SMD/SMT; Material: Ferrite; Military Standard: Not; Number of Lines: 1; DC Current: 500mA; Length: 1.6mm; REACH SVHC: No SVHC; Lead Free: Lead Free; Current Rating: 500mA; Max Current Rating: 500mA; Packaging: Tape and Reel; Case Code (Metric): 1608; Height: 0.8mm
R1 R2 = CMP-2002-06462-1: as R3 on sheet CC2640
U2 = SFH7072: Sensor biométrico

## Nets that join several sheets
GND: CC2640 (L3.1 L4.1), Alimentación (13 pins), Actuadores (Buzz1.2 LED1,2.1 LED1,2.3 Q1.2), ADLX362 (5 pins), BME680 (5 pins), AFE4220 (14 pins)
GND1: CC2640 (15 pins), Antena RF (C19.1 C20.1 F1.1)
TX_SUP: CC2640 (J1.5 R3.2 U3.18 U3.28), Alimentación (C26.1 C27.1 R6.2 U5.5), AFE4220 (8 pins)
V2V1: Alimentación (6 pins), ADLX362 (C28.2 C29.2 U6.1 U6.14), BME680 (5 pins), AFE4220 (L1.1)
V2V1_filt: CC2640 (6 pins), AFE4220 (7 pins)
VBAT: CC2640 (U3.11), Alimentación (8 pins), Actuadores (Buzz1.1 M1.1), AFE4220 (C9.1 U1.C4)
NetC20_2: CC2640 (U3.1), Antena RF (C20.2 L5.2 L6.1)
NetL5_1: CC2640 (U3.2), Antena RF (L5.1)
NetR1_2: CC2640 (U3.26), AFE4220 (R1.2)
NetR8_1: CC2640 (U3.15), Actuadores (R8.1)
NetR9_1: CC2640 (U3.20), Actuadores (R9.1)
NetR10_1: CC2640 (U3.16), Actuadores (R10.1)
NetR11_1: CC2640 (U3.10), Actuadores (R11.1)
NetU1_E1: CC2640 (U3.27), AFE4220 (U1.E1)
NetU1_E2: CC2640 (U3.22), ADLX362 (U6.7), AFE4220 (U1.E2)
NetU1_E3: CC2640 (U3.8), AFE4220 (U1.E3)
NetU1_F2: CC2640 (U3.21), ADLX362 (U6.6), AFE4220 (U1.F2)
NetU1_F3: CC2640 (U3.25), ADLX362 (U6.4), AFE4220 (U1.F3)
NetU1_F4: CC2640 (U3.9), AFE4220 (U1.F4)
NetU3_6: CC2640 (U3.6), BME680 (U7.4)
NetU3_7: CC2640 (U3.7), BME680 (U7.2)
NetU3_24: CC2640 (U3.24), ADLX362 (U6.8)